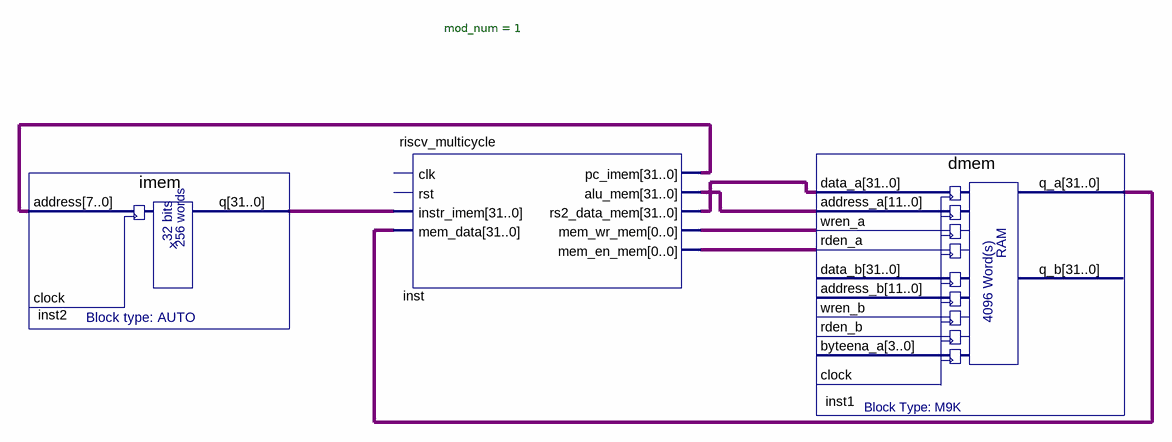
[diagram p0: schematic sheet]
// Quartus schematic riscv_multicycle.bdf as structural Verilog: 3 symbols, 0 pins
module riscv_multicycle (
);

  wire inst_mem_en_mem, inst_mem_wr_mem;
  wire [31:0] inst1_q_a, inst2_q, inst_alu_mem, inst_pc_imem, inst_rs2_data_mem;

  imem inst2 (.address(inst_pc_imem), .q(inst2_q));  // open: clock
  riscv_multicycle #(.mod_num(1)) inst (
    .instr_imem(inst2_q), .mem_data(inst1_q_a), .pc_imem(inst_pc_imem), .alu_mem(inst_alu_mem),
    .rs2_data_mem(inst_rs2_data_mem), .mem_wr_mem(inst_mem_wr_mem), .mem_en_mem(inst_mem_en_mem));  // open: clk, rst
  dmem inst1 (
    .data_a(inst_rs2_data_mem), .address_a(inst_alu_mem), .wren_a(inst_mem_wr_mem), .rden_a(inst_mem_en_mem),
    .q_a(inst1_q_a));  // open: data_b, address_b, wren_b, rden_b, byteena_a, clock, q_b
endmodule
